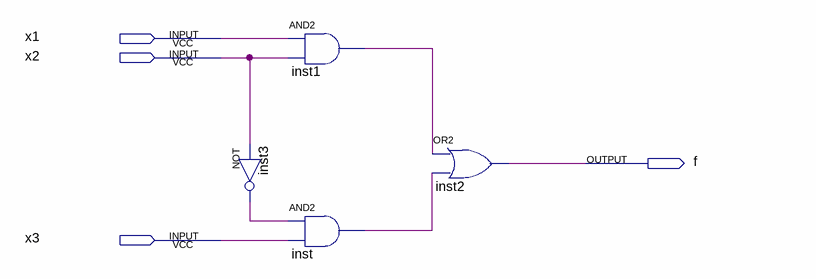
[diagram p0: schematic sheet]
// Quartus schematic Coe328Lab1Schematic1.bdf as structural Verilog: 4 symbols, 4 pins
module Coe328Lab1Schematic1 (
  input  x1,
  input  x2,
  input  x3,
  output f
);

  wire inst1_out, inst3_out, inst_out;

  and inst1 (inst1_out, x1, x2);
  not inst3 (inst3_out, x2);
  and inst (inst_out, inst3_out, x3);
  or inst2 (f, inst1_out, inst_out);
endmodule
